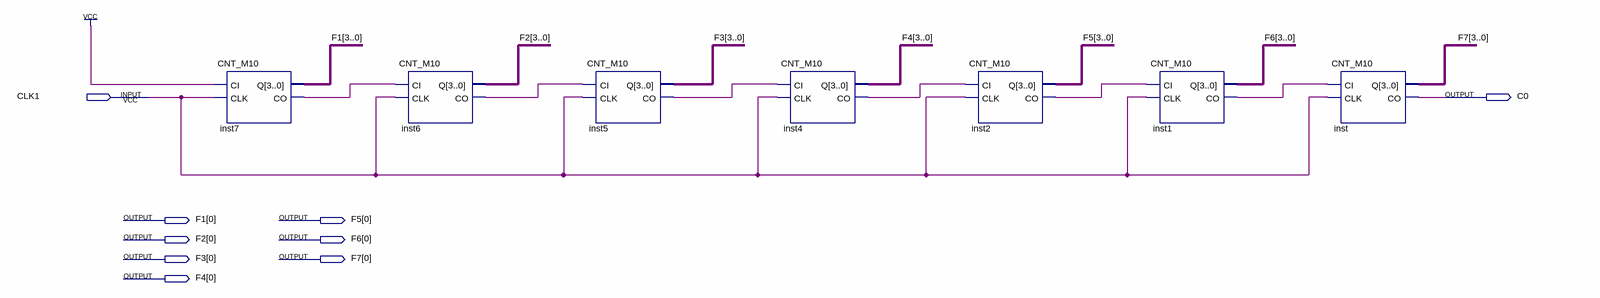
[diagram p0: schematic sheet]
// Quartus schematic m10-7.bdf as structural Verilog: 7 symbols, 9 pins
module \m10-7  (
  input  CLK1,
  output C0,
  output [3:0] F1,
  output [3:0] F5,
  output [3:0] F2,
  output [3:0] F6,
  output [3:0] F3,
  output [3:0] F7,
  output [3:0] F4
);

  wire inst1_co, inst2_co, inst4_co, inst5_co, inst6_co, inst7_co;

  CNT_M10 inst7 (.CI(1'b1), .CLK(CLK1), .Q(F1), .CO(inst7_co));
  CNT_M10 inst6 (.CI(inst7_co), .CLK(CLK1), .Q(F2), .CO(inst6_co));
  CNT_M10 inst5 (.CI(inst6_co), .CLK(CLK1), .Q(F3), .CO(inst5_co));
  CNT_M10 inst4 (.CI(inst5_co), .CLK(CLK1), .Q(F4), .CO(inst4_co));
  CNT_M10 inst2 (.CI(inst4_co), .CLK(CLK1), .Q(F5), .CO(inst2_co));
  CNT_M10 inst1 (.CI(inst2_co), .CLK(CLK1), .Q(F6), .CO(inst1_co));
  CNT_M10 inst (.CI(inst1_co), .CLK(CLK1), .Q(F7), .CO(C0));
endmodule
